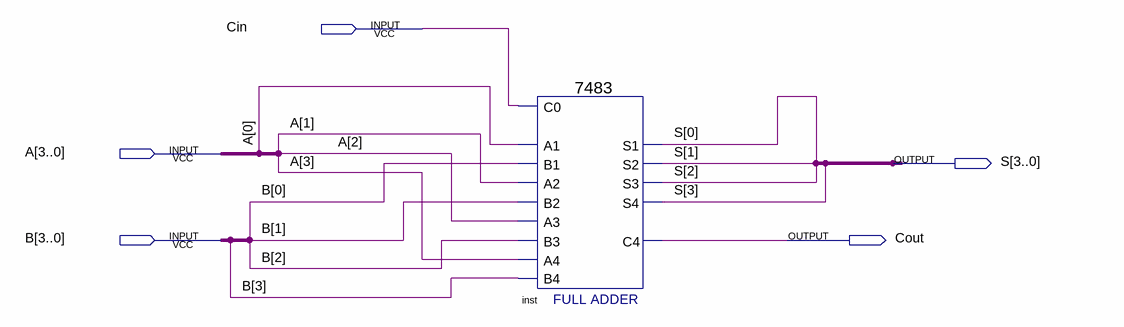
[diagram p0: schematic sheet]
// Quartus schematic Sumador.bdf as structural Verilog: 1 symbols, 5 pins
module Sumador (
  input  Cin,
  input  [3:0] A,
  input  [3:0] B,
  output [3:0] S,
  output Cout
);

  \7483  inst (
    .B4(B[3]), .C0(Cin), .A1(A[0]), .A2(A[1]), .B1(B[0]), .B2(B[1]), .A3(A[2]), .B3(B[2]), .A4(A[3]),
    .S3(S[2]), .S4(S[3]), .S2(S[1]), .C4(Cout), .S1(S[0]));
endmodule
